# Altium project 1Rv2.PrjPCB (part 1 of 2)
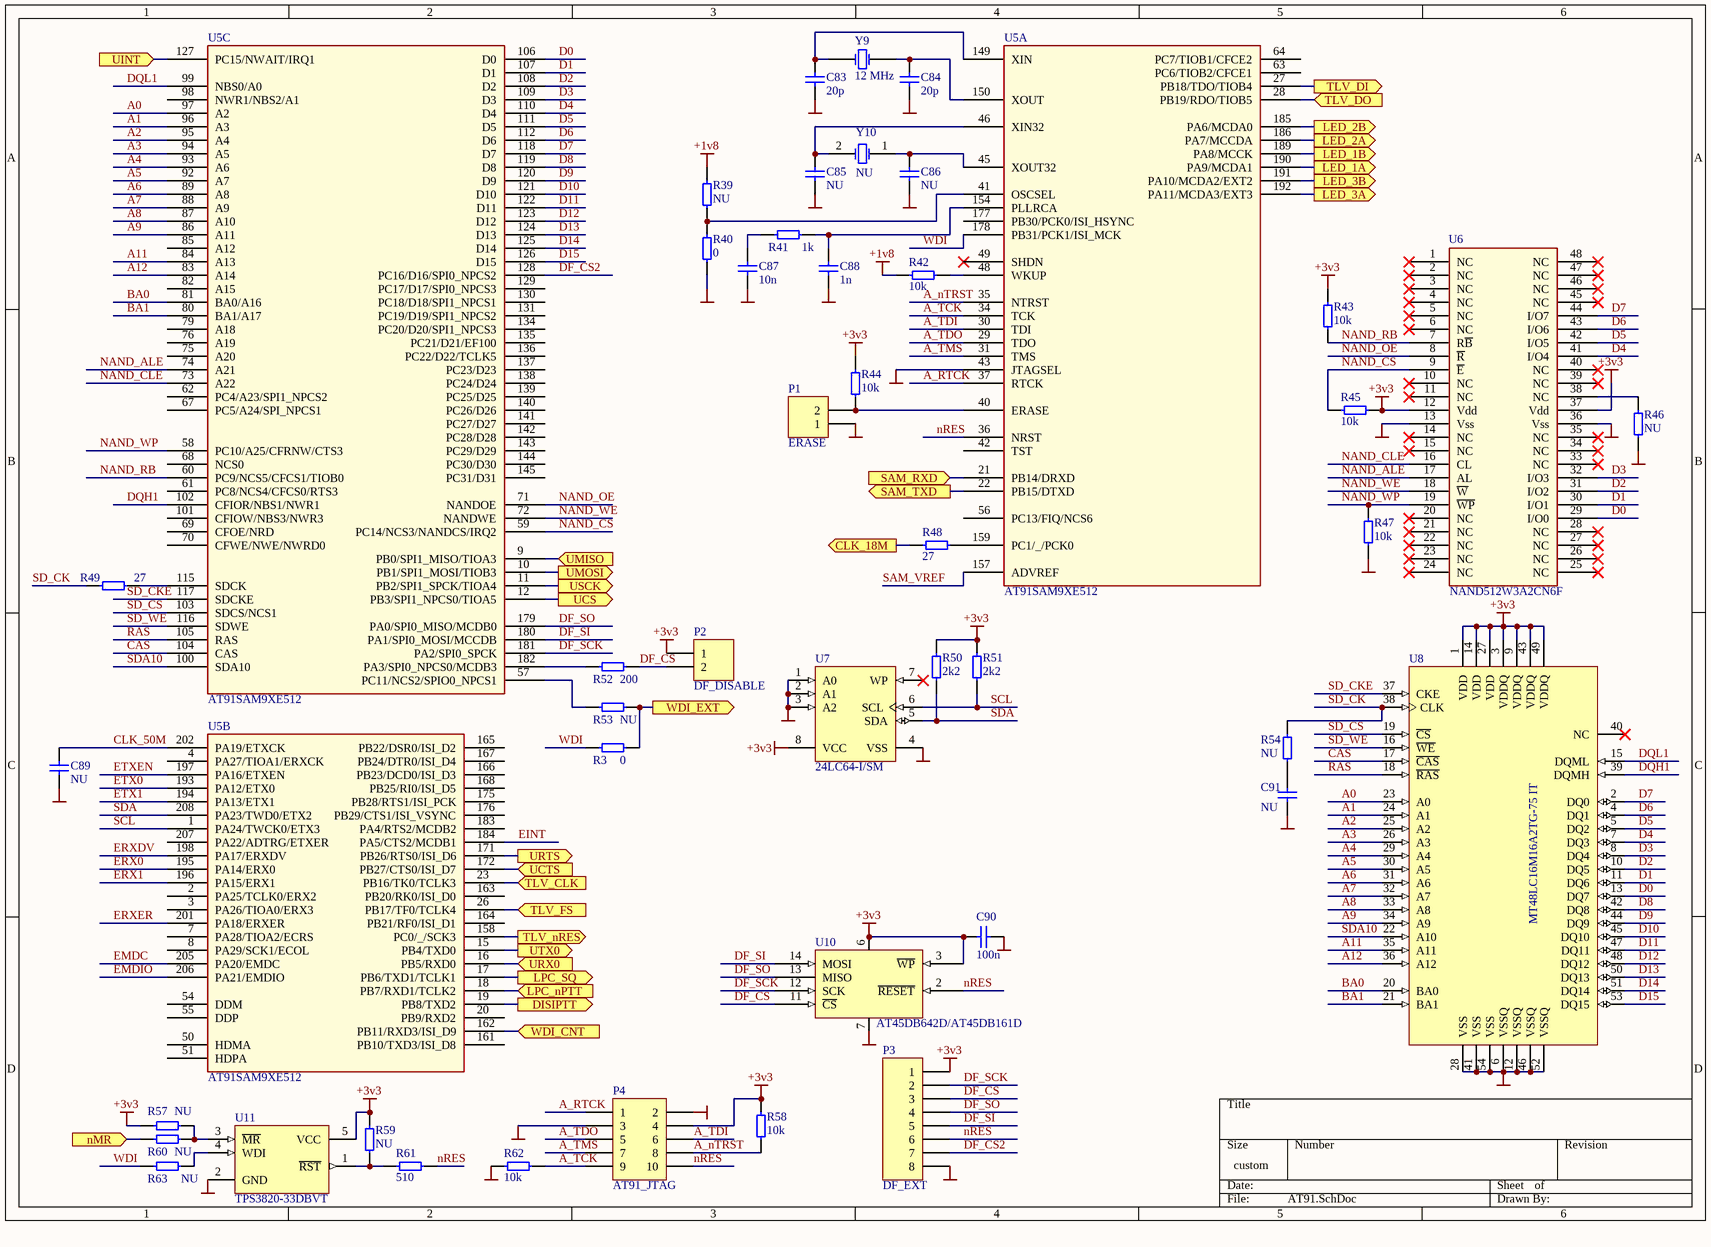
[diagram p0: AT91.SchDoc]
6 sheets, 522 parts. Net scope: global (net labels, ports and power ports of the same name join across sheets).
Board file: Voice_Base_PCB.PcbDoc
Sheets:
  AT91.SchDoc
  INTERFACE.SchDoc
  LPC.SchDoc
  PWR.SchDoc
  RF_ADF.SchDoc
  RF_VCO.SchDoc

## Sheet AT91.SchDoc
size 320 x 228 mm; DocumentNumber: 1; SheetNumber: 1; SheetTotal: 5

### Parts
C83  20p  [CAPC1608L]
C84  20p  [CAPC1608L]
C85  NU  [CAPC1608L]
C86  NU  [CAPC1608L]
C87  10n  [CAPC1608L]
C88  1n  [CAPC1608L]
C89  NU  [CAPC1608L]
C90  100n  [CAPC1608N]
C91  NU  [CAPC1608L]
P1  ERASE  [HDR1X2]
P2  DF_DISABLE  [HDR1X2]
P3  DF_EXT  [HDR1X8]
P4  AT91_JTAG  [HDR2X5]
R3  0  [RESC1608L]
R39  NU  [RESC1608L]
R40  0  [RESC1608L]
R41  1k  [RESC1608L]
R42  10k  [RESC1608L]
R43  10k  [RESC1608L]
R44  10k  [RESC1608L]
R45  10k  [RESC1608L]
R46  NU  [RESC1608L]
R47  10k  [RESC1608L]
R48  27  [RESC1608L]
R49  27  [RESC1608L]
R50  2k2  [RESC1608L]
R51  2k2  [RESC1608L]
R52  200  [RESC1608L]
R53  NU  [RESC1608L]
R54  NU  [RESC1608L]
R57  NU  [RESC1608L]
R58  10k  [RESC1608L]
R59  NU  [RESC1608L]
R60  NU  [RESC1608L]
R61  510  [RESC1608L]
R62  10k  [RESC1608L]
R63  NU  [RESC1608L]
U5  AT91SAM9XE512  [SQFP50P3120X3120-208N]  (parts A,B,C of 4)
U6  NAND512W3A2CN6F  [TSSOP50P2000-48AN]
U7  24LC64-I/SM  [SOIJ-SM8_L]
U8  MT48LC16M16A2TG-75 IT  [SOP80P1176-54N]
U10  AT45DB642D/AT45DB161D  [TSSOP55P1340-28BN]
U11  TPS3820-33DBVT  [SOT23-5]
Y9  12 MHz  [HC49/S]
Y10  NU  [R38]

### Ports
CLK_18M (out), DISIPTT (out), LED_1A (out), LED_1B (out), LED_2A (out), LED_2B (out), LED_3A (out), LED_3B (out), LPC_nPTT (in), LPC_SQ (out), nMR (in), SAM_RXD (in), SAM_TXD (out), TLV_CLK (in), TLV_DI (out), TLV_DO (in), TLV_FS (in), TLV_nRES (out), UCS (out), UCTS (in), UINT (in), UMISO (in), UMOSI (out), URTS (out), URX0 (in), USCK (out), UTX0 (out), WDI_CNT (in), WDI_EXT (out)

### Nets
+1v8: R39.2 R42.2
+3v3: C90.2 P2.1 P3.1 P4.4 R43.2 R44.2 R45.1 R50.2 R51.2 R57.1 R58.2 R59.2 U6.12(Vdd) U6.37(Vdd) U7.8(VCC) U8.1(VDD) U8.3(VDDQ) U8.9(VDDQ) U8.14(VDD) U8.27(VDD) U8.43(VDDQ) U8.49(VDDQ) U10.3(~{WP}) U10.6(VCC) U11.5(VCC)
GND: C83.2 C84.2 C85.2 C86.2 C87.2 C88.2 C89.1 C90.1 C91.1 P1.1 P3.8 P4.2 P4.3 R40.1 R46.2 R47.1 R62.2 U5.43(JTAGSEL) U6.13(Vss) U6.36(Vss) U7.1(A0) U7.2(A1) U7.3(A2) U7.4(VSS) U8.6(VSSQ) U8.12(VSSQ) U8.28(VSS) U8.41(VSS) U8.46(VSSQ) U8.52(VSSQ) U8.54(VSS) U10.7(GND) U11.2(GND)
A0: U5.97(A2) U8.23(A0)
A1: U5.96(A3) U8.24(A1)
A2: U5.95(A4) U8.25(A2)
A3: U5.94(A5) U8.26(A3)
A4: U5.93(A6) U8.29(A4)
A5: U5.92(A7) U8.30(A5)
A6: U5.89(A8) U8.31(A6)
A7: U5.88(A9) U8.32(A7)
A8: U5.87(A10) U8.33(A8)
A9: U5.86(A11) U8.34(A9)
A11: U5.84(A13) U8.35(A11)
A12: U5.83(A14) U8.36(A12)
A_nTRST: P4.8 R58.1 U5.35(NTRST)
A_RTCK: P4.1 U5.37(RTCK)
A_TCK: P4.9 R62.1 U5.34(TCK)
A_TDI: P4.6 U5.30(TDI)
A_TDO: P4.5 U5.29(TDO)
A_TMS: P4.7 U5.31(TMS)
BA0: U5.81(BA0/A16) U8.20(BA0)
BA1: U5.80(BA1/A17) U8.21(BA1)
CAS: U5.104(CAS) U8.17(~{CAS})
CLK_18M: R48.2 ; port CLK_18M
CLK_50M: C89.2 U5.202(PA19/ETXCK)
D0: U5.106(D0) U6.29(I/O0) U8.13(DQ7)
D1: U5.107(D1) U6.30(I/O1) U8.11(DQ6)
D2: U5.108(D2) U6.31(I/O2) U8.10(DQ5)
D3: U5.109(D3) U6.32(I/O3) U8.8(DQ4)
D4: U5.110(D4) U6.41(I/O4) U8.7(DQ3)
D5: U5.111(D5) U6.42(I/O5) U8.5(DQ2)
D6: U5.112(D6) U6.43(I/O6) U8.4(DQ1)
D7: U5.118(D7) U6.44(I/O7) U8.2(DQ0)
D8: U5.119(D8) U8.42(DQ8)
D9: U5.120(D9) U8.44(DQ9)
D10: U5.121(D10) U8.45(DQ10)
D11: U5.122(D11) U8.47(DQ11)
D12: U5.123(D12) U8.48(DQ12)
D13: U5.124(D13) U8.50(DQ13)
D14: U5.125(D14) U8.51(DQ14)
D15: U5.126(D15) U8.53(DQ15)
DF_CS: P2.2 P3.3 R52.1 U10.11(~{CS})
DF_CS2: P3.7 U5.128(PC16/D16/SPI0_NPCS2)
DF_SCK: P3.2 U5.181(PA2/SPI0_SPCK) U10.12(SCK)
DF_SI: P3.5 U5.180(PA1/SPI0_MOSI/MCCDB) U10.14(MOSI)
DF_SO: P3.4 U5.179(PA0/SPI0_MISO/MCDB0) U10.13(MISO)
DISIPTT: U5.19(PB8/TXD2) ; port DISIPTT
DQH1: U5.102(CFIOR/NBS1/NWR1) U8.39(DQMH)
DQL1: U5.99(NBS0/A0) U8.15(DQML)
EINT: U5.184(PA5/CTS2/MCDB1)
EMDC: U5.205(PA20/EMDC)
EMDIO: U5.206(PA21/EMDIO)
ERX0: U5.195(PA14/ERX0)
ERX1: U5.196(PA15/ERX1)
ERXDV: U5.198(PA17/ERXDV)
ERXER: U5.201(PA18/ERXER)
ETX0: U5.193(PA12/ETX0)
ETX1: U5.194(PA13/ETX1)
ETXEN: U5.197(PA16/ETXEN)
LED_1A: U5.190(PA9/MCDA1) ; port LED_1A
LED_1B: U5.189(PA8/MCCK) ; port LED_1B
LED_2A: U5.186(PA7/MCCDA) ; port LED_2A
LED_2B: U5.185(PA6/MCDA0) ; port LED_2B
LED_3A: U5.192(PA11/MCDA3/EXT3) ; port LED_3A
LED_3B: U5.191(PA10/MCDA2/EXT2) ; port LED_3B
LPC_nPTT: U5.18(PB7/RXD1/TCLK2) ; port LPC_nPTT
LPC_SQ: U5.17(PB6/TXD1/TCLK1) ; port LPC_SQ
NAND_ALE: U5.74(A21) U6.17(AL)
NAND_CLE: U5.73(A22) U6.16(CL)
NAND_CS: R45.2 U5.59(PC14/NCS3/NANDCS/IRQ2) U6.9(~{E})
NAND_OE: U5.71(NANDOE) U6.8(~{R})
NAND_RB: R43.1 U5.60(PC9/NCS5/CFCS1/TIOB0) U6.7(R~{B})
NAND_WE: U5.72(NANDWE) U6.18(~{W})
NAND_WP: R47.2 U5.58(PC10/A25/CFRNW/CTS3) U6.19(~{WP})
nMR: R60.1 ; port nMR
nRES: P3.6 P4.10 R61.1 U5.36(NRST) U10.2(~{RESET})
RAS: U5.105(RAS) U8.18(~{RAS})
SAM_RXD: U5.21(PB14/DRXD) ; port SAM_RXD
SAM_TXD: U5.22(PB15/DTXD) ; port SAM_TXD
SAM_VREF: U5.157(ADVREF)
SCL: R51.1 U5.1(PA24/TWCK0/ETX3) U7.6(SCL)
SD_CK: R49.2 R54.2 U8.38(CLK)
SD_CKE: U5.117(SDCKE) U8.37(CKE)
SD_CS: U5.103(SDCS/NCS1) U8.19(~{CS})
SD_WE: U5.116(SDWE) U8.16(~{WE})
SDA: R50.1 U5.208(PA23/TWD0/ETX2) U7.5(SDA)
SDA10: U5.100(SDA10) U8.22(A10)
TLV_CLK: U5.23(PB16/TK0/TCLK3) ; port TLV_CLK
TLV_DI: U5.27(PB18/TDO/TIOB4) ; port TLV_DI
TLV_DO: U5.28(PB19/RDO/TIOB5) ; port TLV_DO
TLV_FS: U5.26(PB17/TF0/TCLK4) ; port TLV_FS
TLV_nRES: U5.158(PC0/_/SCK3) ; port TLV_nRES
UCS: U5.12(PB3/SPI1_NPCS0/TIOA5) ; port UCS
UCTS: U5.172(PB27/CTS0/ISI_D7) ; port UCTS
UINT: U5.127(PC15/NWAIT/IRQ1) ; port UINT
UMISO: U5.9(PB0/SPI1_MISO/TIOA3) ; port UMISO
UMOSI: U5.10(PB1/SPI1_MOSI/TIOB3) ; port UMOSI
URTS: U5.171(PB26/RTS0/ISI_D6) ; port URTS
URX0: U5.16(PB5/RXD0) ; port URX0
USCK: U5.11(PB2/SPI1_SPCK/TIOA4) ; port USCK
UTX0: U5.15(PB4/TXD0) ; port UTX0
WDI: R3.1 R63.2 U5.178(PB31/PCK1/ISI_MCK)
WDI_CNT: U5.162(PB11/RXD3/ISI_D9) ; port WDI_CNT
WDI_EXT: R3.2 R53.2 ; port WDI_EXT
NetC83_1: C83.1 U5.149(XIN) Y9.1(OSC1)
NetC84_1: C84.1 U5.150(XOUT) Y9.2(OSC2)
NetC85_1: C85.1 U5.46(XIN32) Y10.2(OSC2)
NetC86_1: C86.1 U5.45(XOUT32) Y10.1(OSC1)
NetC87_1: C87.1 R41.2
NetC88_1: C88.1 R41.1 U5.154(PLLRCA)
NetC91_2: C91.2 R54.1
NetP1_2: P1.2 R44.1 U5.40(ERASE)
NetR39_1: R39.1 R40.2 U5.41(OSCSEL)
NetR42_1: R42.1 U5.48(WKUP)
NetR46_1: R46.1 U6.38(NC)
NetR48_1: R48.1 U5.159(PC1/_/PCK0)
NetR49_1: R49.1 U5.115(SDCK)
NetR52_2: R52.2 U5.182(PA3/SPI0_NPCS0/MCDB3)
NetR53_1: R53.1 U5.57(PC11/NCS2/SPIO0_NPCS1)
NetR57_2: R57.2 R60.2 U11.3(~{MR})
NetR59_1: R59.1 R61.2 U11.1(~{RST})
NetR63_1: R63.1 U11.4(WDI)

Not connected (* = marked no-connect by the designer): U5 2(PA25/TCLK0/ERX2) 3(PA26/TIOA0/ERX3) 4(PA27/TIOA1/ERXCK) 7(PA28/TIOA2/ECRS) 8(PA29/SCK1/ECOL) 20(PB9/RXD2) 42(TST) 49(SHDN)* 50(HDMA) 51(HDPA) 54(DDM) 55(DDP) 56(PC13/FIQ/NCS6) 61(PC8/NCS4/CFCS0/RTS3) 62(PC4/A23/SPI1_NPCS2) 63(PC6/TIOB2/CFCE1) 64(PC7/TIOB1/CFCE2) 67(PC5/A24/SPI_NPCS1) 68(NCS0) 69(CFOE/NRD) 70(CFWE/NWE/NWRD0) 75(A20) 76(A19) 79(A18) 82(A15) 85(A12) 98(NWR1/NBS2/A1) 101(CFIOW/NBS3/NWR3) 129(PC17/D17/SPI0_NPCS3) 130(PC18/D18/SPI1_NPCS1) 131(PC19/D19/SPI1_NPCS2) 134(PC20/D20/SPI1_NPCS3) 135(PC21/D21/EF100) 136(PC22/D22/TCLK5) 137(PC23/D23) 138(PC24/D24) 139(PC25/D25) 140(PC26/D26) 141(PC27/D27) 142(PC28/D28) 143(PC29/D29) 144(PC30/D30) 145(PC31/D31) 161(PB10/TXD3/ISI_D8) 163(PB20/RK0/ISI_D0) 164(PB21/RF0/ISI_D1) 165(PB22/DSR0/ISI_D2) 166(PB23/DCD0/ISI_D3) 167(PB24/DTR0/ISI_D4) 168(PB25/RI0/ISI_D5) 175(PB28/RTS1/ISI_PCK) 176(PB29/CTS1/ISI_VSYNC) 177(PB30/PCK0/ISI_HSYNC) 183(PA4/RTS2/MCDB2) 207(PA22/ADTRG/ETXER); U6 1(NC)* 2(NC)* 3(NC)* 4(NC)* 5(NC)* 6(NC)* 10(NC)* 11(NC)* 14(NC)* 15(NC)* 20(NC)* 21(NC)* 22(NC)* 23(NC)* 24(NC)* 25(NC)* 26(NC)* 27(NC)* 28(NC)* 33(NC)* 34(NC)* 35(NC)* 39(NC)* 40(NC)* 45(NC)* 46(NC)* 47(NC)* 48(NC)*; U7 7(WP)*; U8 40(NC)*

### Library data of the parts
C83-C91 = Cap: Capacitor; Value: 100pF; Published: 8-Jun-2000; LatestRevisionDate: 17-Jul-2002; LatestRevisionNote: Re-released for DXP Platform.; PackageReference: RAD-0.3; Publisher: Altium Limited
P1 P2 = Header 2: Header, 2-Pin; LatestRevisionDate: 17-Jul-2002; LatestRevisionNote: Re-released for DXP Platform.; Publisher: Altium Limited
P3 = Header 8: Header, 8-Pin; LatestRevisionDate: 17-Jul-2002; LatestRevisionNote: Re-released for DXP Platform.; Publisher: Altium Limited
P4 = Header 5X2: Header, 5-Pin, Dual row; LatestRevisionDate: 17-Jul-2002; LatestRevisionNote: Re-released for DXP Platform.; Publisher: Altium Limited
R3 R39 R40 R42-R54 R57-R63 = Res: Resistor; Value: 1K; Published: 8-Jun-2000; LatestRevisionDate: 04-Mar-2005; LatestRevisionNote: PCB Footprint replaced.; PackageReference: J1-0603; Publisher: Altium Limited
R41 = Res: Resistor; Published: 8-Jun-2000; LatestRevisionDate: 04-Mar-2005; LatestRevisionNote: PCB Footprint replaced.; PackageReference: J1-0603; Publisher: Altium Limited; Value: 1K
U6 = NAND256W3A2BN6E: 256Mbit 528B/264 Word Page , 1.8/3V NAND Flash(x8)
U7 = 24LC128-I/SM: 128Kbit, 400kHz, 2.5V, I2C Serial EEPROM, 8-Pin SOIC 208mil, Industrial Temperature; Published: 29-Jan-2009; DatasheetVersion: revQ, Jun-2008; PackageVersion: revAW, Oct-2008; PackageReference: SOIJ-SM8; Publisher: Altium Limited; PackageDescription: 8-Lead Plastic Small Outline (SM) - Medium, 5.28 mm Body [SOIJ]; ComponentLink1Description: Manufacturer Link; ComponentLink1URL: http://www.microchip.com; ComponentLink2Description: Datasheet; ComponentLink2URL: http://ww1.microchip.com/downloads/en/DeviceDoc/21191Q.pdf; ComponentLink3Description: Packaging Specification; ComponentLink3URL: http://ww1.microchip.com/downloads/en/PackagingSpec/00049AW.pdf
U8 = MT48LC16M16A2TG-75 IT: 256Mb Synchronous High-Speed CMOS DRAM, 16Mb x 16Bit x 4 Banks, 54-Pin TSOP, Industrial; CycleTime: 7.5ns @ CL = 3 (PC133); RowAddress: 8K (A0-A12); ColumnAddress: 512 (A0-A8); Published: 11-Oct-2004; LatestRevisionDate: 13-Apr-2006; LatestRevisionNote: IPC-7351 Footprint Added.; DatasheetVersion: rev.G, Sep-2003; PackageVersion: Sep-2003; PackageReference: TSOP2-54; Publisher: Altium Limited; PackageDescription: 54-Pin Plastic Small Outline Package 0.8 mm Pitch; Code_JEDEC: MS-024-FA; ComponentLink1Description: Manufacturer Link; ComponentLink1URL: http://www.micron.com; ComponentLink2Description: Datasheet; ComponentLink2URL: http://download.micron.com/pdf/datasheets/dram/sdram/256MSDRAM.pdf
U10 = AT45DB642D: 64 Mb 2.5/2.7 V DataFlash
U11 = MAX823LEUK: 5-Pin Microprocessor Supervisory Circuit; Published: 16-Jan-2001; LatestRevisionDate: 17-Jul-2002; LatestRevisionNote: Re-released for DXP Platform.; DatasheetVersion: Jun-1997; PackageReference: SOT23-5; Publisher: Altium Limited; PackageDescription: SOT-23/SC-74A; 5 Leads; Body 3 x 3 mm, inc. leads (LxW max); ComponentLink1Description: Manufacturer Link; ComponentLink1URL: http://www.maxim-ic.com/; ComponentLink2Description: Datasheet; ComponentLink2URL: http://pdfserv.maxim-ic.com/en/ds/MAX823-MAX825.pdf
Y9 Y10 = XTAL: Crystal Oscillator; Published: 8-Jun-2000; LatestRevisionDate: 17-Jul-2002; LatestRevisionNote: Re-released for DXP Platform.; PackageReference: R38; Publisher: Altium Limited

## Sheet INTERFACE.SchDoc
size 320 x 228 mm; DocumentNumber: 3; SheetNumber: 3; SheetTotal: 5
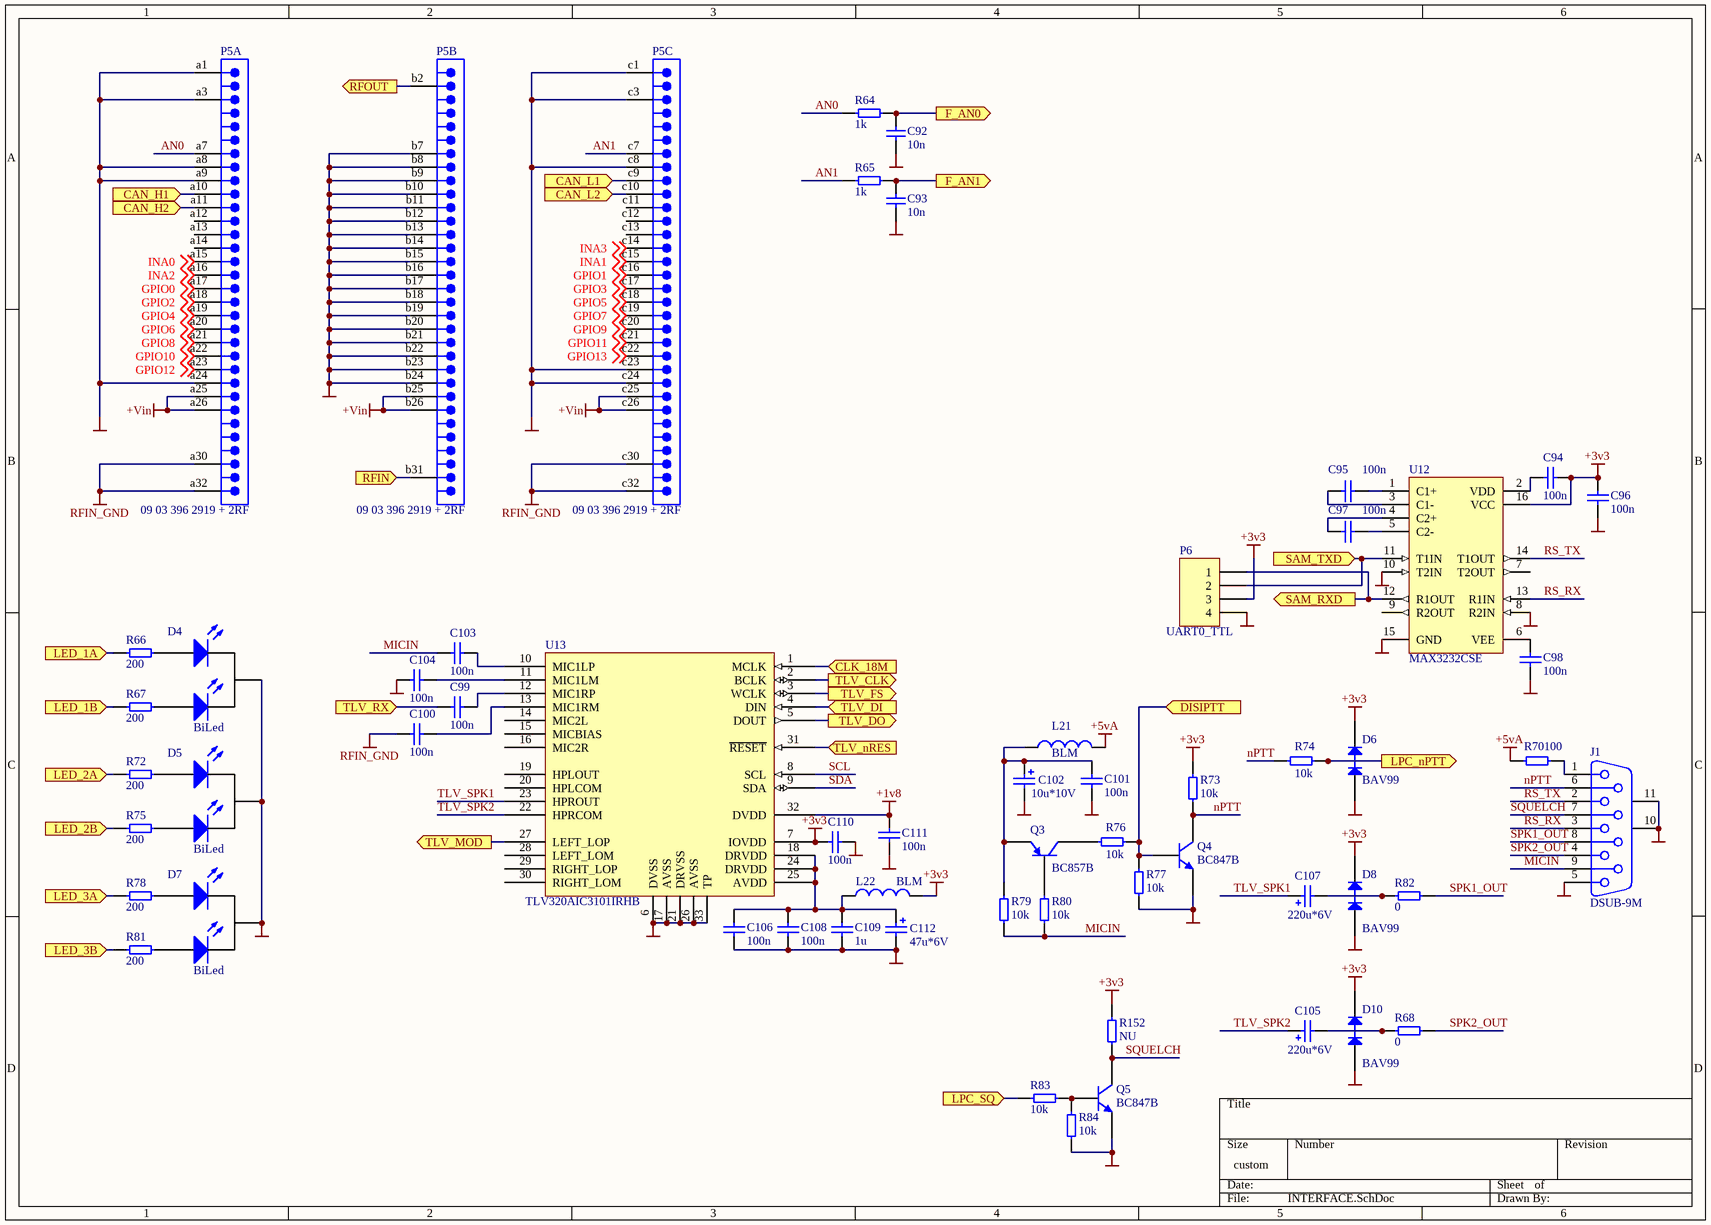
[diagram p1: INTERFACE.SchDoc]

### Parts
C92  10n  [CAPC1608L]
C93  10n  [CAPC1608L]
C94  100n  [CAPC1608N]
C95  100n  [CAPC1608N]
C96  100n  [CAPC1608N]
C97  100n  [CAPC1608N]
C98  100n  [CAPC1608N]
C99  100n  [CAPC1608N]
C100  100n  [CAPC1608N]
C101  100n  [CAPC1608N]
C102  10u*10V  [Case_A]
C103  100n  [CAPC1608N]
C104  100n  [CAPC1608N]
C105  220u*6V  [Case_C]
C106  100n  [CAPC1608N]
C107  220u*6V  [Case_C]
C108  100n  [CAPC1608N]
C109  1u  [CAPC2012N]
C110  100n  [CAPC1608N]
C111  100n  [CAPC1608N]
C112  47u*6V  [Case_A]
D4  BiLed  [BLED-1]
D5  BiLed  [BLED-1]
D6  BAV99  [SOT-23]
D7  BiLed  [BLED-1]
D8  BAV99  [SOT-23]
D10  BAV99  [SOT-23]
J1  DSUB-9M  [DSUB1.385-2H9]
L21  BLM  [INDC2012L]
L22  BLM  [INDC2012L]
P5  09 03 396 2919 + 2RF  [0903396x919]  (parts A,B,C of 4)
P6  UART0_TTL  [HDR1X4]
Q3  BC857B  [SOT23_N]
Q4  BC847B  [SOT23_N]
Q5  BC847B  [SOT23_N]
R64  1k  [RESC1608L]
R65  1k  [RESC1608L]
R66  200  [RESC1608L]
R67  200  [RESC1608L]
R68  0  [RESC2012L]
R70  100  [RESC2012L]
R72  200  [RESC1608L]
R73  10k  [RESC1608L]
R74  10k  [RESC1608L]
R75  200  [RESC1608L]
R76  10k  [RESC1608L]
R77  10k  [RESC1608L]
R78  200  [RESC1608L]
R79  10k  [RESC1608L]
R80  10k  [RESC1608L]
R81  200  [RESC1608L]
R82  0  [RESC2012L]
R83  10k  [RESC1608L]
R84  10k  [RESC1608L]
R152  NU  [RESC1608L]
U12  MAX3232CSE  [NSO16_N]
U13  TLV320AIC3101IRHB  [QFN50P500X500-32W6N]

### Ports
CAN_H1 (in), CAN_H2 (in), CAN_L1 (in), CAN_L2 (in), CLK_18M (in), DISIPTT (in), F_AN0 (out), F_AN1 (out), LED_1A (in), LED_1B (in), LED_2A (in), LED_2B (in), LED_3A (in), LED_3B (in), LPC_nPTT (out), LPC_SQ (in), RFIN (in), RFOUT (out), SAM_RXD (out), SAM_TXD (in), TLV_CLK (out), TLV_DI (in), TLV_DO (out), TLV_FS (out), TLV_MOD (out), TLV_nRES (in), TLV_RX (in)

### Nets
+1v8: C111.2 U13.32(DVDD)
+3v3: C94.1 C96.2 C110.2 D6.2(K) D8.2(K) D10.2(K) L22.1 P6.3 R73.2 R152.2 U12.16(VCC) U13.7(IOVDD)
+5vA: L21.2 R70.1
+Vin: P5.a25 P5.a26 P5.b25 P5.b26 P5.c25 P5.c26
GND: C92.1 C93.1 C96.1 C98.1 C101.2 C102.2 C104.2 C106.1 C108.1 C109.1 C110.1 C111.1 C112.2 D4.2 D5.2 D6.1(A) D7.2 D8.1(A) D10.1(A) J1.5 J1.10(MH1) J1.11(MH2) P5.a1 P5.a3 P5.a8 P5.a9 P5.a24 P5.b7 P5.b8 P5.b9 P5.b10 P5.b11 P5.b12 P5.b13 P5.b14 P5.b15 P5.b16 P5.b17 P5.b18 P5.b19 P5.b20 P5.b21 P5.b22 P5.b23 P5.b24 P5.c1 P5.c3 P5.c8 P5.c23 P5.c24 P6.4 Q4.2(E) Q5.2(E) R77.1 R84.2 U12.8(R2IN) U12.10(T2IN) U12.15(GND) U13.6(DVSS) U13.17(AVSS) U13.21(DRVSS) U13.26(AVSS) U13.33(TP)
RFIN_GND: C100.2 P5.a30 P5.a32 P5.c30 P5.c32
AN0: P5.a7 R64.1
AN1: P5.c7 R65.1
CAN_H1: P5.a10 ; port CAN_H1
CAN_H2: P5.a11 ; port CAN_H2
CAN_L1: P5.c9 ; port CAN_L1
CAN_L2: P5.c10 ; port CAN_L2
CLK_18M: U13.1(MCLK) ; port CLK_18M
DISIPTT: Q4.1(B) R76.1 R77.2 ; port DISIPTT
F_AN0: C92.2 R64.2 ; port F_AN0
F_AN1: C93.2 R65.2 ; port F_AN1
GPIO0: P5.a17 ; off-sheet GPIO0
GPIO1: P5.c16 ; off-sheet GPIO1
GPIO2: P5.a18 ; off-sheet GPIO2
GPIO3: P5.c17 ; off-sheet GPIO3
GPIO4: P5.a19 ; off-sheet GPIO4
GPIO5: P5.c18 ; off-sheet GPIO5
GPIO6: P5.a20 ; off-sheet GPIO6
GPIO7: P5.c19 ; off-sheet GPIO7
GPIO8: P5.a21 ; off-sheet GPIO8
GPIO9: P5.c20 ; off-sheet GPIO9
GPIO10: P5.a22 ; off-sheet GPIO10
GPIO11: P5.c21 ; off-sheet GPIO11
GPIO12: P5.a23 ; off-sheet GPIO12
GPIO13: P5.c22 ; off-sheet GPIO13
INA0: P5.a15 ; off-sheet INA0
INA1: P5.c15 ; off-sheet INA1
INA2: P5.a16 ; off-sheet INA2
INA3: P5.c14 ; off-sheet INA3
LED_1A: R66.2 ; port LED_1A
LED_1B: R67.2 ; port LED_1B
LED_2A: R72.2 ; port LED_2A
LED_2B: R75.2 ; port LED_2B
LED_3A: R78.2 ; port LED_3A
LED_3B: R81.2 ; port LED_3B
LPC_nPTT: D6.3(C) R74.1 ; port LPC_nPTT
LPC_SQ: R83.1 ; port LPC_SQ
MICIN: C103.1 J1.9 R79.1 R80.1
nPTT: J1.6 Q4.3(C) R73.1 R74.2
RFIN: P5.b31 ; port RFIN
RFOUT: P5.b2 ; port RFOUT
RS_RX: J1.3 U12.13(R1IN)
RS_TX: J1.2 U12.14(T1OUT)
SAM_RXD: P6.1 U12.12(R1OUT) ; port SAM_RXD
SAM_TXD: P6.2 U12.11(T1IN) ; port SAM_TXD
SCL: U13.8(SCL)
SDA: U13.9(SDA)
SPK1_OUT: J1.8 R82.2
SPK2_OUT: J1.4 R68.2
SQUELCH: J1.7 Q5.3(C) R152.1
TLV_CLK: U13.2(BCLK) ; port TLV_CLK
TLV_DI: U13.4(DIN) ; port TLV_DI
TLV_DO: U13.5(DOUT) ; port TLV_DO
TLV_FS: U13.3(WCLK) ; port TLV_FS
TLV_MOD: U13.27(LEFT_LOP) ; port TLV_MOD
TLV_nRES: U13.31(~{RESET}) ; port TLV_nRES
TLV_RX: C99.1 ; port TLV_RX
TLV_SPK1: C107.1 U13.23(HPROUT)
TLV_SPK2: C105.1 U13.22(HPRCOM)
NetC94_2: C94.2 U12.2(VDD)
NetC95_1: C95.1 U12.3(C1-)
NetC95_2: C95.2 U12.1(C1+)
NetC97_1: C97.1 U12.4(C2+)
NetC97_2: C97.2 U12.5(C2-)
NetC98_2: C98.2 U12.6(VEE)
NetC99_2: C99.2 U13.12(MIC1RP)
NetC100_1: C100.1 U13.13(MIC1RM)
NetC101_1: C101.1 C102.1 L21.1 Q3.2(E) R79.2
NetC103_2: C103.2 U13.10(MIC1LP)
NetC104_1: C104.1 U13.11(MIC1LM)
NetC105_2: C105.2 D10.3(C) R68.1
NetC106_2: C106.2 C108.2 C109.2 C112.1 L22.2 U13.18(DRVDD) U13.24(DRVDD) U13.25(AVDD)
NetC107_2: C107.2 D8.3(C) R82.1
NetD4_1: D4.1 R66.1
NetD4_3: D4.3 R67.1
NetD5_1: D5.1 R72.1
NetD5_3: D5.3 R75.1
NetD7_1: D7.1 R78.1
NetD7_3: D7.3 R81.1
NetJ1_1: J1.1 R70.2
NetQ3_1: Q3.1(B) R80.2
NetQ3_3: Q3.3(C) R76.2
NetQ5_1: Q5.1(B) R83.2 R84.1

Not connected (* = marked no-connect by the designer): P5 a12 a13 a14 c11 c12 c13; U12 7(T2OUT) 9(R2OUT); U13 14(MIC2L) 15(MICBIAS) 16(MIC2R) 19(HPLOUT) 20(HPLCOM) 28(LEFT_LOM) 29(RIGHT_LOP) 30(RIGHT_LOM)

### Library data of the parts
C92-C101 C103 C104 C106 C108-C111 = Cap: Capacitor; Value: 100pF; Published: 8-Jun-2000; LatestRevisionDate: 17-Jul-2002; LatestRevisionNote: Re-released for DXP Platform.; PackageReference: RAD-0.3; Publisher: Altium Limited
C102 C105 C107 C112 = Cap Pol: Polarized Capacitor (Surface Mount); Value: 100pF; Published: 8-Jun-2000; LatestRevisionDate: 17-Jul-2002; LatestRevisionNote: Re-released for DXP Platform.; PackageReference: C0805; Publisher: Altium Limited
D6 D8 D10 = BAV99: Silicon Switching Diode Array for High-Speed Switching; Published: 21-Mar-2003; DatasheetDocument: Oct-1999; PackageDocument: Sep-2001; PackageReference: SOT-23; Publisher: Altium Limited; ComponentLink1Description: Manufacturer Link; ComponentLink1URL: http://www.infineon.com/; ComponentLink2Description: Datasheet; ComponentLink2URL: http://www.infineon.com/upload/Document/cmc_upload/documents/080/631/bav99series_1.pdf
J1 = D Connector 9: Receptacle Assembly, 9 Position, Right Angle; PackageDocument: O; Positions: 9; Published: 15-Jun-2001; LatestRevisionDate: 17-Jul-2002; LatestRevisionNote: Re-released for DXP Platform.; DatasheetDocument: 1-Sep-1999; PackageReference: 788750; Publisher: Altium Limited; Orientation: Right Angle; Gender: Receptacle
L21 L22 = INDUCTOR
P5 = 09 03 396 2919: Eurocard DIN 41612, Type C, 96 Position, Rows a+b+c, Performance level 1, Male, Lead 3.0 mm, Pitch 2.54 mm; DrillSize: Corresponds to nominal value.; Published: 6-Oct-2005; DatasheetDocument: 03-Jun-2003; PackageDocument: 25-Jan-2002; PackageReference: 0903396x919; Publisher: Altium Limited; ComponentLink1Description: Manufacturer Link; ComponentLink1URL: http://www.harting.com/; ComponentLink2Description: Packaging Specification; ComponentLink2URL: http://www.harkis.harting.com/_gds/pdf/TB_0903396x919_BL01_R30797.pdf
P6 = Header 4: Header, 4-Pin; LatestRevisionDate: 17-Jul-2002; LatestRevisionNote: Re-released for DXP Platform.; Publisher: Altium Limited
Q3 = BC857B: PNP General-purpose Transistor; Published: 17-Sep-2003; LatestRevisionDate: 12-Dec-2006; LatestRevisionNote: IPC-7351 Footprint Added.; DatasheetVersion: 4-Feb-2002; PackageVersion: May-1999; PackageReference: SOT23; Publisher: Altium Limited; PackageDescription: 3-Pin SOT-23 Package 0.95 mm Pitch, 2.3 mm Lead Span; ComponentLink1Description: Manufacturer Link; ComponentLink1URL: http://www.semiconductors.philips.com/; ComponentLink2Description: Datasheet; ComponentLink2URL: http://www.semiconductors.philips.com/acrobat/datasheets/BC856_BC857_BC858_6.pdf
Q4 Q5 = BC847B: NPN General-purpose Transistor; Published: 17-Sep-2003; LatestRevisionDate: 12-Dec-2006; LatestRevisionNote: IPC-7351 Footprint Added.; DatasheetVersion: 4-Feb-2002; PackageVersion: May-1999; PackageReference: SOT23; Publisher: Altium Limited; PackageDescription: 3-Pin SOT-23 Package 0.95 mm Pitch, 2.3 mm Lead Span; ComponentLink1Description: Manufacturer Link; ComponentLink1URL: http://www.semiconductors.philips.com/; ComponentLink2Description: Datasheet; ComponentLink2URL: http://www.semiconductors.philips.com/acrobat/datasheets/BC846_BC847_BC848_5.pdf
R64 R65 = Res: Resistor; Published: 8-Jun-2000; LatestRevisionDate: 04-Mar-2005; LatestRevisionNote: PCB Footprint replaced.; PackageReference: J1-0603; Publisher: Altium Limited; Value: 1K
R66-R68 R70 R72-R84 R152 = Res: Resistor; Value: 1K; Published: 8-Jun-2000; LatestRevisionDate: 04-Mar-2005; LatestRevisionNote: PCB Footprint replaced.; PackageReference: J1-0603; Publisher: Altium Limited
U12 = MAX232CSE: +5V Powered, Multi-Channel RS-232 Driver/Receiver; Published: 16-Jan-2001; LatestRevisionDate: 13-Apr-2006; LatestRevisionNote: IPC-7351 Footprint Added.; PackageReference: NSO16; Publisher: Altium Limited; PackageDescription: 16-Pin Small Outline Integrated Circuit 1.27 mm Pitch; Code_JEDEC: MS-012-AC; Code_IPC: SOIC127P600-16; ComponentLink1Description: Manufacturer Link; ComponentLink1URL: http://www.maxim-ic.com/; ComponentLink2Description: Datasheet; ComponentLink2URL: http://pdfserv.maxim-ic.com/en/ds/MAX220-MAX249.pdf
U13 = TLV320AIC3101IRHB: Low-power stereo codec

## Sheet LPC.SchDoc
size 320 x 228 mm; DocumentNumber: 2; SheetNumber: 2; SheetTotal: 5
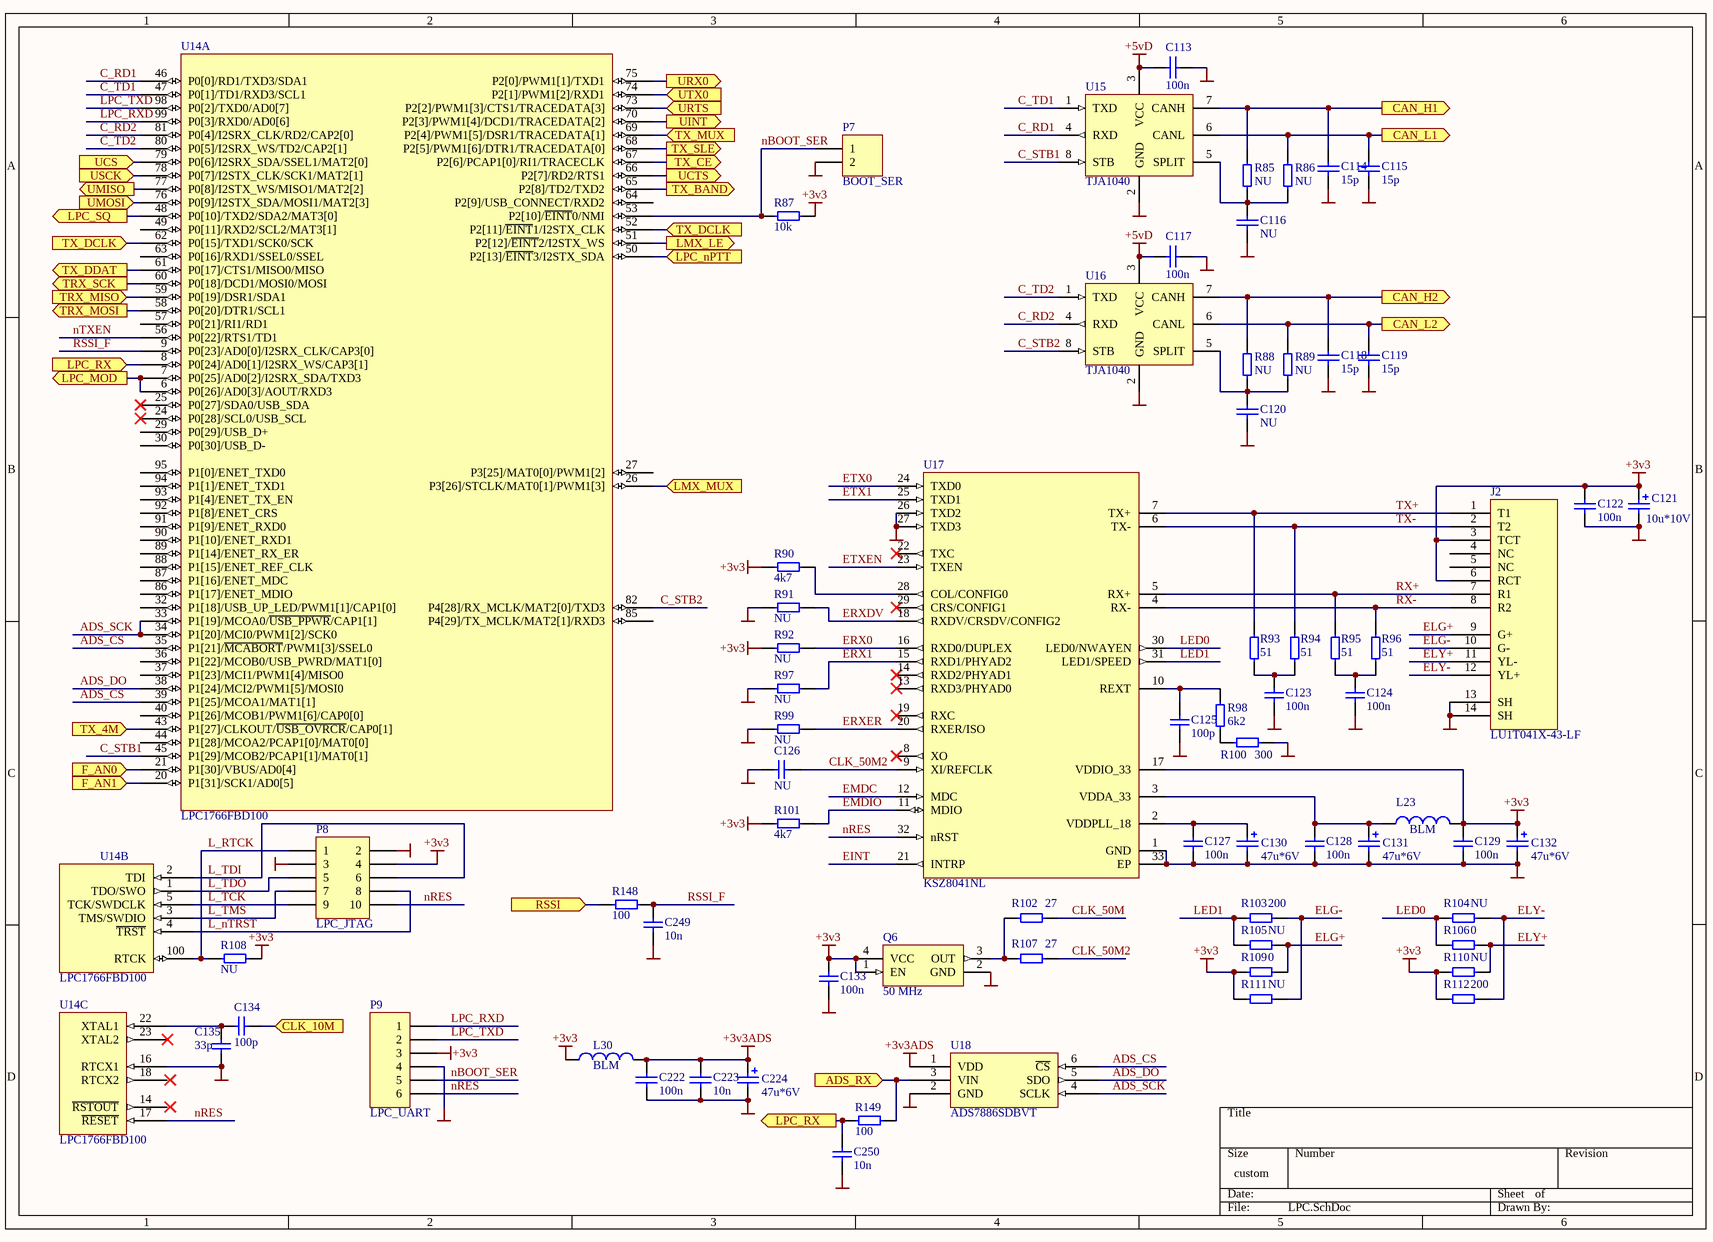
[diagram p2: LPC.SchDoc]

### Parts
C113  100n  [CAPC1608N]
C114  15p  [CAPC1608N]
C115  15p  [CAPC1608N]
C116  NU  [CAPC1608N]
C117  100n  [CAPC1608N]
C118  15p  [CAPC1608N]
C119  15p  [CAPC1608N]
C120  NU  [CAPC1608N]
C121  10u*10V  [Case_A]
C122  100n  [CAPC1608N]
C123  100n  [CAPC1608L]
C124  100n  [CAPC1608L]
C125  100p  [CAPC1608L]
C126  NU  [CAPC1608L]
C127  100n  [CAPC1608L]
C128  100n  [CAPC1608L]
C129  100n  [CAPC1608L]
C130  47u*6V  [Case_A]
C131  47u*6V  [Case_A]
C132  47u*6V  [Case_A]
C133  100n  [CAPC1608L]
C134  100p  [CAPC1608L]
C135  33p  [CAPC1608L]
C222  100n  [CAPC1608N]
C223  10n  [CAPC1608N]
C224  47u*6V  [Case_A]
C249  10n  [CAPC1608L]
C250  10n  [CAPC1608L]
J2  LU1T041X-43-LF  [JACK1.27-4H8C]
L23  BLM  [INDC2012L]
L30  BLM  [CAPC2012N]
P7  BOOT_SER  [HDR1X2]
P8  LPC_JTAG  [HDR2X5]
P9  LPC_UART  [HDR1X6]
Q6  50 MHz  [XTAL_7.5_5mm]
R85  NU  [RESC2012L]
R86  NU  [RESC2012L]
R87  10k  [RESC1608L]
R88  NU  [RESC2012L]
R89  NU  [RESC2012L]
R90  4k7  [RESC1608L]
R91  NU  [RESC1608L]
R92  NU  [RESC1608L]
R93  51  [RESC1608L]
R94  51  [RESC1608L]
R95  51  [RESC1608L]
R96  51  [RESC1608L]
R97  NU  [RESC1608L]
R98  6k2  [RESC1608L]
R99  NU  [RESC1608L]
R100  300  [RESC1608L]
R101  4k7  [RESC1608L]
R102  27  [RESC1608L]
R103  200  [RESC1608L]
R104  NU  [RESC1608L]
R105  NU  [RESC1608L]
R106  0  [RESC1608L]
R107  27  [RESC1608L]
R108  NU  [RESC1608L]
R109  0  [RESC1608L]
R110  NU  [RESC1608L]
R111  NU  [RESC1608L]
R112  200  [RESC1608L]
R148  100  [RESC1608L]
R149  100  [RESC1608L]
U14  LPC1766FBD100  [SOT407-1_L]  (parts A,B,C of 4)
U15  TJA1040  [SOIC-150-8]
U16  TJA1040  [SOIC-150-8]
U17  KSZ8041NL  [QFN50P500X500-32WAN]
U18  ADS7886SDBVT  [SOT26A-6N]

### Ports
ADS_RX (in), CAN_H1 (out), CAN_H2 (out), CAN_L1 (out), CAN_L2 (out), CLK_10M (in), F_AN0 (in), F_AN1 (in), LMX_LE (out), LMX_MUX (in), LPC_MOD (out), LPC_nPTT (in), LPC_RX (in), LPC_RX (out), LPC_SQ (out), RSSI (in), TRX_MISO (in), TRX_MOSI (out), TRX_SCK (out), TX_4M (in), TX_BAND (out), TX_CE (out), TX_DCLK (in), TX_DDAT (out), TX_MUX (in), TX_SLE (out), UCS (in), UCTS (out), UINT (out), UMISO (out), UMOSI (in), URTS (in), URX0 (out), USCK (in), UTX0 (in)

### Nets
+3v3: C121.1 C122.2 C129.2 C132.1 C133.2 J2.3(TCT) J2.6(RCT) L23.2 L30.1 P8.4 P9.3 Q6.1(EN) Q6.4(VCC) R87.2 R90.2 R92.2 R101.2 R108.1 R109.2 R110.2 R111.2 R112.2 U17.17(VDDIO_33)
+3v3ADS: C222.2 C223.2 C224.1 L30.2 U18.1(VDD)
+5vD: C113.1 C117.1 U15.3(VCC) U16.3(VCC)
GND: C113.2 C114.1 C115.1 C116.1 C117.2 C118.1 C119.1 C120.1 C121.2 C122.1 C123.1 C124.1 C125.1 C126.2 C127.1 C128.1 C129.1 C130.2 C131.2 C132.2 C133.1 C135.1 C222.1 C223.1 C224.2 C249.1 C250.1 J2.13(SH) J2.14(SH) P7.2 P8.2 P8.3 P9.4 Q6.2(GND) R91.2 R97.2 R99.2 R100.1 U14.16(RTCX1) U15.2(GND) U16.2(GND) U17.1(GND) U17.26(TXD2) U17.27(TXD3) U17.33(EP) U18.2(GND)
ADS_CS: U14.35(P1[21]/~{MCABORT}/PWM1[3]/SSEL0) U14.39(P1[25]/MCOA1/MAT1[1]) U18.6(~{CS})
ADS_DO: U14.38(P1[24]/MCI2/PWM1[5]/MOSI0) U18.5(SDO)
ADS_RX: R149.2 U18.3(VIN) ; port ADS_RX
ADS_SCK: U14.33(P1[19]/MCOA0/~{USB_PPWR}/CAP1[1]) U14.34(P1[20]/MCI0/PWM1[2]/SCK0) U18.4(SCLK)
C_RD1: U14.46(P0[0]/RD1/TXD3/SDA1) U15.4(RXD)
C_RD2: U14.81(P0[4]/I2SRX_CLK/RD2/CAP2[0]) U16.4(RXD)
C_STB1: U14.45(P1[29]/MCOB2/PCAP1[1]/MAT0[1]) U15.8(STB)
C_STB2: U14.82(P4[28]/RX_MCLK/MAT2[0]/TXD3) U16.8(STB)
C_TD1: U14.47(P0[1]/TD1/RXD3/SCL1) U15.1(TXD)
C_TD2: U14.80(P0[5]/I2SRX_WS/TD2/CAP2[1]) U16.1(TXD)
CAN_H1: C114.2 R85.1 U15.7(CANH) ; port CAN_H1
CAN_H2: C118.2 R88.1 U16.7(CANH) ; port CAN_H2
CAN_L1: C115.2 R86.1 U15.6(CANL) ; port CAN_L1
CAN_L2: C119.2 R89.1 U16.6(CANL) ; port CAN_L2
CLK_10M: C134.2 ; port CLK_10M
CLK_50M: R102.2
CLK_50M2: C126.1 R107.2 U17.9(XI/REFCLK)
EINT: U17.21(INTRP)
ELG+: J2.9(G+) R105.1 R109.1
ELG-: J2.10(G-) R103.1 R111.1
ELY+: J2.11(YL-) R106.1 R110.1
ELY-: J2.12(YL+) R104.1 R112.1
EMDC: U17.12(MDC)
EMDIO: R101.1 U17.11(MDIO)
ERX0: R92.1 U17.16(RXD0/DUPLEX)
ERX1: R97.1 U17.15(RXD1/PHYAD2)
ERXDV: R91.1 U17.18(RXDV/CRSDV/CONFIG2)
ERXER: R99.1 U17.20(RXER/ISO)
ETX0: U17.24(TXD0)
ETX1: U17.25(TXD1)
ETXEN: U17.23(TXEN)
F_AN0: U14.21(P1[30]/VBUS/AD0[4]) ; port F_AN0
F_AN1: U14.20(P1[31]/SCK1/AD0[5]) ; port F_AN1
L_nTRST: P8.8 U14.4(~{TRST})
L_RTCK: P8.1 R108.2 U14.100(RTCK)
L_TCK: P8.9 U14.5(TCK/SWDCLK)
L_TDI: P8.6 U14.2(TDI)
L_TDO: P8.5 U14.1(TDO/SWO)
L_TMS: P8.7 U14.3(TMS/SWDIO)
LED0: R104.2 R106.2 U17.30(LED0/NWAYEN)
LED1: R103.2 R105.2 U17.31(LED1/SPEED)
LMX_LE: U14.51(P2[12]/~{EINT}2/I2STX_WS) ; port LMX_LE
LMX_MUX: U14.26(P3[26]/STCLK/MAT0[1]/PWM1[3]) ; port LMX_MUX
LPC_MOD: U14.6(P0[26]/AD0[3]/AOUT/RXD3) U14.7(P0[25]/AD0[2]/I2SRX_SDA/TXD3) ; port LPC_MOD
LPC_nPTT: U14.50(P2[13]/~{EINT}3/I2STX_SDA) ; port LPC_nPTT
LPC_RX: C250.2 R149.1 U14.8(P0[24]/AD0[1]/I2SRX_WS/CAP3[1]) ; port LPC_RX
LPC_RXD: P9.1 U14.99(P0[3]/RXD0/AD0[6])
LPC_SQ: U14.48(P0[10]/TXD2/SDA2/MAT3[0]) ; port LPC_SQ
LPC_TXD: P9.2 U14.98(P0[2]/TXD0/AD0[7])
nBOOT_SER: P7.1 P9.5 R87.1 U14.53(P2[10]/~{EINT}0/NMI)
nRES: P8.10 P9.6 U14.17(~{RESET}) U17.32(nRST)
nTXEN: U14.56(P0[22]/RTS1/TD1)
RSSI: R148.1 ; port RSSI
RSSI_F: C249.2 R148.2 U14.9(P0[23]/AD0[0]/I2SRX_CLK/CAP3[0])
RX+: J2.7(R1) R95.2 U17.5(RX+)
RX-: J2.8(R2) R96.2 U17.4(RX-)
TRX_MISO: U14.59(P0[19]/DSR1/SDA1) ; port TRX_MISO
TRX_MOSI: U14.58(P0[20]/DTR1/SCL1) ; port TRX_MOSI
TRX_SCK: U14.60(P0[18]/DCD1/MOSI0/MOSI) ; port TRX_SCK
TX+: J2.1(T1) R93.2 U17.7(TX+)
TX-: J2.2(T2) R94.2 U17.6(TX-)
TX_4M: U14.43(P1[27]/CLKOUT/~{USB_OVRCR}/CAP0[1]) ; port TX_4M
TX_BAND: U14.65(P2[8]/TD2/TXD2) ; port TX_BAND
TX_CE: U14.67(P2[6]/PCAP1[0]/RI1/TRACECLK) ; port TX_CE
TX_DCLK: U14.52(P2[11]/~{EINT}1/I2STX_CLK) U14.62(P0[15]/TXD1/SCK0/SCK) ; port TX_DCLK
TX_DDAT: U14.61(P0[17]/CTS1/MISO0/MISO) ; port TX_DDAT
TX_MUX: U14.69(P2[4]/PWM1[5]/DSR1/TRACEDATA[1]) ; port TX_MUX
TX_SLE: U14.68(P2[5]/PWM1[6]/DTR1/TRACEDATA[0]) ; port TX_SLE
UCS: U14.79(P0[6]/I2SRX_SDA/SSEL1/MAT2[0]) ; port UCS
UCTS: U14.66(P2[7]/RD2/RTS1) ; port UCTS
UINT: U14.70(P2[3]/PWM1[4]/DCD1/TRACEDATA[2]) ; port UINT
UMISO: U14.77(P0[8]/I2STX_WS/MISO1/MAT2[2]) ; port UMISO
UMOSI: U14.76(P0[9]/I2STX_SDA/MOSI1/MAT2[3]) ; port UMOSI
URTS: U14.73(P2[2]/PWM1[3]/CTS1/TRACEDATA[3]) ; port URTS
URX0: U14.75(P2[0]/PWM1[1]/TXD1) ; port URX0
USCK: U14.78(P0[7]/I2STX_CLK/SCK1/MAT2[1]) ; port USCK
UTX0: U14.74(P2[1]/PWM1[2]/RXD1) ; port UTX0
NetC116_2: C116.2 R85.2 R86.2 U15.5(SPLIT)
NetC120_2: C120.2 R88.2 R89.2 U16.5(SPLIT)
NetC123_2: C123.2 R93.1 R94.1
NetC124_2: C124.2 R95.1 R96.1
NetC125_2: C125.2 R98.2 U17.10(REXT)
NetC127_2: C127.2 C130.1 U17.2(VDDPLL_18)
NetC128_2: C128.2 C131.1 L23.1 U17.3(VDDA_33)
NetC134_1: C134.1 C135.2 U14.22(XTAL1)
NetQ6_3: Q6.3(OUT) R102.1 R107.1
NetR90_1: R90.1 U17.28(COL/CONFIG0)
NetR98_1: R98.1 R100.2

Not connected (* = marked no-connect by the designer): J2 4(NC) 5(NC); U14 14(~{RSTOUT}) 18(RTCX2) 23(XTAL2)* 24(P0[28]/SCL0/USB_SCL)* 25(P0[27]/SDA0/USB_SDA)* 27(P3[25]/MAT0[0]/PWM1[2]) 29(P0[29]/USB_D+) 30(P0[30]/USB_D-) 32(P1[18]/USB_UP_LED/PWM1[1]/CAP1[0]) 36(P1[22]/MCOB0/USB_PWRD/MAT1[0]) 37(P1[23]/MCI1/PWM1[4]/MISO0) 40(P1[26]/MCOB1/PWM1[6]/CAP0[0]) 44(P1[28]/MCOA2/PCAP1[0]/MAT0[0]) 49(P0[11]/RXD2/SCL2/MAT3[1]) 57(P0[21]/RI1/RD1) 63(P0[16]/RXD1/SSEL0/SSEL) 64(P2[9]/USB_CONNECT/RXD2) 85(P4[29]/TX_MCLK/MAT2[1]/RXD3) 86(P1[17]/ENET_MDIO) 87(P1[16]/ENET_MDC) 88(P1[15]/ENET_REF_CLK) 89(P1[14]/ENET_RX_ER) 90(P1[10]/ENET_RXD1) 91(P1[9]/ENET_RXD0) 92(P1[8]/ENET_CRS) 93(P1[4]/ENET_TX_EN) 94(P1[1]/ENET_TXD1) 95(P1[0]/ENET_TXD0); U17 8(XO)* 13(RXD3/PHYAD0)* 14(RXD2/PHYAD1)* 19(RXC)* 22(TXC)* 29(CRS/CONFIG1)*

### Library data of the parts
C113-C120 C122-C129 C133-C135 C222 C223 C249 C250 = Cap: Capacitor; Value: 100pF; Published: 8-Jun-2000; LatestRevisionDate: 17-Jul-2002; LatestRevisionNote: Re-released for DXP Platform.; PackageReference: RAD-0.3; Publisher: Altium Limited
C121 C130-C132 C224 = Cap Pol: as C102 on sheet INTERFACE; Published: 8-Jun-2000; LatestRevisionDate: 17-Jul-2002; LatestRevisionNote: Re-released for DXP Platform.; PackageReference: C0805; Publisher: Altium Limited
J2 = LU1T516-43: Ethernet 10/100 jack with magnetics
L23 = INDUCTOR
L30 = Ferrite Bead: Code_IEC: 1005; Value: 10mH; Published: 8-Jun-2000; LatestRevisionDate: 17-Jul-2002; LatestRevisionNote: Re-released for DXP Platform.; PackageReference: 0402-A; Publisher: Altium Limited; Code_JEITA: 0402
P7 = Header 2: Header, 2-Pin; LatestRevisionDate: 17-Jul-2002; LatestRevisionNote: Re-released for DXP Platform.; Publisher: Altium Limited
P8 = Header 5X2: Header, 5-Pin, Dual row; LatestRevisionDate: 17-Jul-2002; LatestRevisionNote: Re-released for DXP Platform.; Publisher: Altium Limited
P9 = Header 6: Header, 6-Pin; LatestRevisionDate: 17-Jul-2002; LatestRevisionNote: Re-released for DXP Platform.; Publisher: Altium Limited
Q6 = XTAL_OSC: Crystal Oscillator
R85-R112 R148 R149 = Res: Resistor; Value: 1K; Published: 8-Jun-2000; LatestRevisionDate: 04-Mar-2005; LatestRevisionNote: PCB Footprint replaced.; PackageReference: J1-0603; Publisher: Altium Limited
U14 = LPC1766FBD100: ARM Cortex-M3 32-Bit Microcontroller, 512kB Flash,64kB SRAM w Ethernet,USB 2.0,Host/Device/OTG, CAN 100-Lead LQFP; Code_IEC: 136E20; Published: 17-Aug-2007; DatasheetVersion: rev.01, Jan-2007; PackageVersion: Feb-2003; PackageReference: SOT407-1; Publisher: Altium Limited; PackageDescription: 100-Pin Plastic Low Profile Quad Flat Pack, LQFP100; Code_JEDEC: MS-026; ComponentLink1Description: Manufacturer Link; ComponentLink1URL: http://www.nxp.com/; ComponentLink2Description: Datasheet; ComponentLink2URL: http://www.standardics.nxp.com/products/lpc2000/datasheet/lpc2364.lpc2366.lpc2368.pdf
U15 U16 = TJA1040: High-Speed CAN Tranceiver
U17 = KSZ8041: 10Base-T/100Base-TX Physical Layer Transceiver
U18 = ADS7886: 12-Bit, 1-MSPS, Micro-power ADC

## Sheet PWR.SchDoc
size 320 x 228 mm; DocumentNumber: 4; SheetNumber: 4; SheetTotal: 5
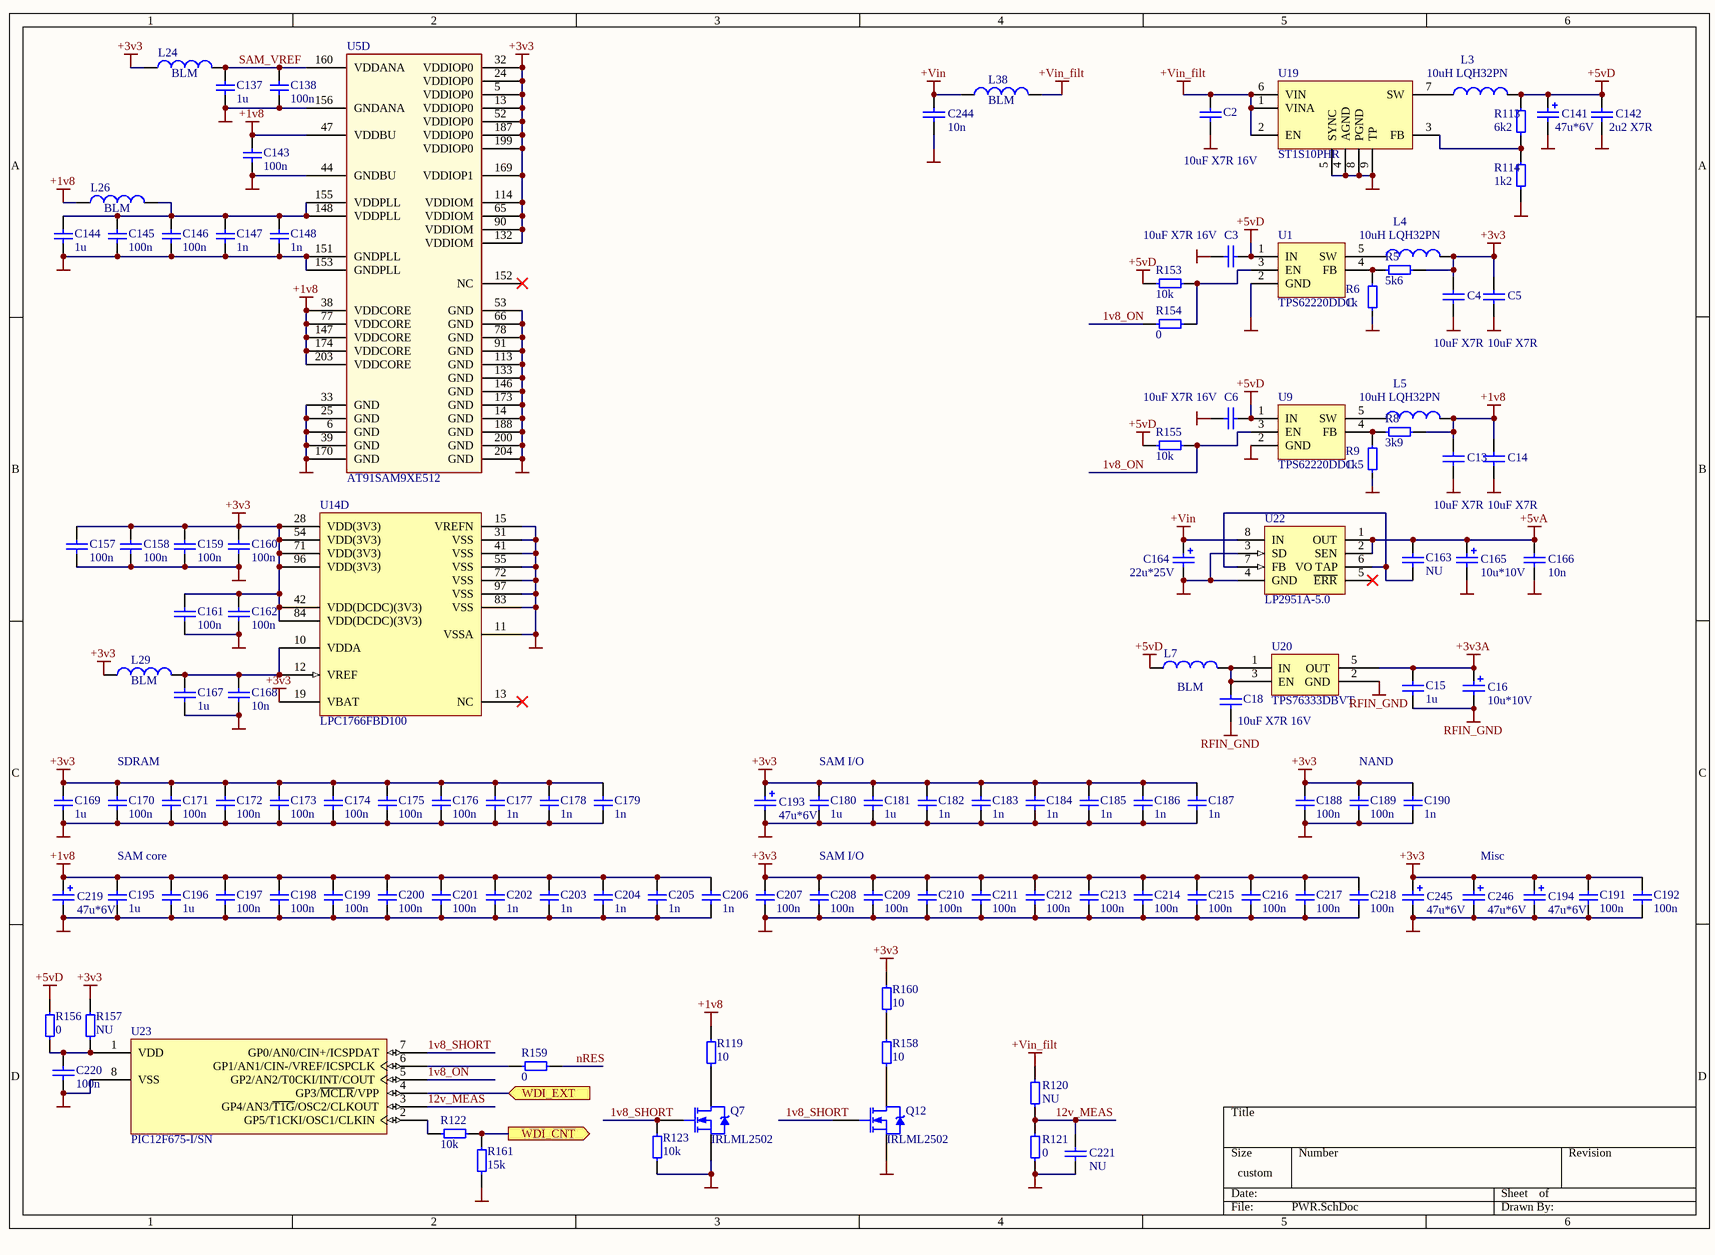
[diagram p3: PWR.SchDoc]

### Parts
C2  10uF X7R 16V  [CAPC3216M]
C3  10uF X7R 16V  [CAPC3216M]
C4  10uF X7R  [CAPC3216M]
C5  10uF X7R  [CAPC3216M]
C6  10uF X7R 16V  [CAPC3216M]
C13  10uF X7R  [CAPC3216M]
C14  10uF X7R  [CAPC3216M]
C15  1u  [CAPC2012L]
C16  10u*10V  [Case_A]
C18  10uF X7R 16V  [CAPC3216M]
C137  1u  [CAPC2012L]
C138  100n  [CAPC1608L]
C141  47u*6V  [Case_A]
C142  2u2 X7R  [CAPC2012N]
C143  100n  [CAPC1608L]
C144  1u  [CAPC2012L]
C145  100n  [CAPC1608L]
C146  100n  [CAPC1608L]
C147  1n  [CAPC1608L]
C148  1n  [CAPC1608L]
C157  100n  [CAPC1608N]
C158  100n  [CAPC1608N]
C159  100n  [CAPC1608N]
C160  100n  [CAPC1608N]
C161  100n  [CAPC1608N]
C162  100n  [CAPC1608N]
C163  NU  [CAPC1608N]
C164  22u*25V  [Case_D]
C165  10u*10V  [Case_A]
C166  10n  [CAPC1608N]
C167  1u  [CAPC2012L]
C168  10n  [CAPC1608N]
C169  1u  [CAPC2012L]
C170  100n  [CAPC1608L]
C171  100n  [CAPC1608L]
C172  100n  [CAPC1608L]
C173  100n  [CAPC1608L]
C174  100n  [CAPC1608L]
C175  100n  [CAPC1608L]
C176  100n  [CAPC1608L]
C177  1n  [CAPC1608L]
C178  1n  [CAPC1608L]
C179  1n  [CAPC1608L]
C180  1u  [CAPC2012L]
C181  1u  [CAPC2012L]
C182  1n  [CAPC1608L]
C183  1n  [CAPC1608L]
C184  1n  [CAPC1608L]
C185  1n  [CAPC1608L]
C186  1n  [CAPC1608L]
C187  1n  [CAPC1608L]
C188  100n  [CAPC1608L]
C189  100n  [CAPC1608L]
C190  1n  [CAPC1608L]
C191  100n  [CAPC1608L]
C192  100n  [CAPC1608L]
C193  47u*6V  [Case_A]
C194  47u*6V  [Case_A]
C195  1u  [CAPC2012L]
C196  1u  [CAPC2012L]
C197  100n  [CAPC1608L]
C198  100n  [CAPC1608L]
C199  100n  [CAPC1608L]
C200  100n  [CAPC1608L]
C201  100n  [CAPC1608L]
C202  1n  [CAPC1608L]
C203  1n  [CAPC1608L]
C204  1n  [CAPC1608L]
C205  1n  [CAPC1608L]
C206  1n  [CAPC1608L]
C207  100n  [CAPC1608L]
C208  100n  [CAPC1608L]
C209  100n  [CAPC1608L]
C210  100n  [CAPC1608L]
C211  100n  [CAPC1608L]
C212  100n  [CAPC1608L]
C213  100n  [CAPC1608L]
C214  100n  [CAPC1608L]
C215  100n  [CAPC1608L]
C216  100n  [CAPC1608L]
C217  100n  [CAPC1608L]
C218  100n  [CAPC1608L]
C219  47u*6V  [Case_A]
C220  100n  [CAPC1608N]
C221  NU  [CAPC1608N]
C244  10n  [CAPC1608N]
C245  47u*6V  [Case_A]
C246  47u*6V  [Case_A]
L3  10uH LQH32PN  [CAPC3225N]
L4  10uH LQH32PN  [CAPC3225N]
L5  10uH LQH32PN  [CAPC3225N]
L7  BLM  [CAPC2012N]
L24  BLM  [INDC2012L]
L26  BLM  [INDC2012L]
L29  BLM  [CAPC2012N]
L38  BLM  [CAPC2012N]
Q7  IRLML2502  [SOT-23]
Q12  IRLML2502  [SOT-23]
R5  5k6  [RESC1608L]
R6  1k  [RESC1608L]
R8  3k9  [RESC1608L]
R9  1k5  [RESC1608L]
R113  6k2  [RESC1608L]
R114  1k2  [RESC1608L]
R119  10  [RESC2012L]
R120  NU  [RESC1608L]
R121  0  [RESC1608L]
R122  10k  [RESC1608L]
R123  10k  [RESC1608L]
R153  10k  [RESC1608L]
R154  0  [RESC1608L]
R155  10k  [RESC1608L]
R156  0  [RESC1608L]
R157  NU  [RESC1608L]
R158  10  [RESC2012L]
R159  0  [RESC1608L]
R160  10  [RESC2012L]
R161  15k  [RESC1608L]
U1  TPS62220DDC  [SOT95P280X160-5L MO-193AB]
U5  AT91SAM9XE512  [SQFP50P3120X3120-208N]  (part D of 4)
U9  TPS62220DDC  [SOT95P280X160-5L MO-193AB]
U14  LPC1766FBD100  [SOT407-1_L]  (part D of 4)
U19  ST1S10PHR  [SOIC127P600X170_HS-8N]
U20  TPS76333DBVT  [SOT95P280X160-5L MO-193AB]
U22  LP2951A-5.0  [M08A_L]
U23  PIC12F675-I/SN  [SOIC-SN8_N]

### Ports
WDI_CNT (out), WDI_EXT (in)

### Nets
+1v8: C13.2 C14.2 C143.2 C195.2 C196.2 C197.2 C198.2 C199.2 C200.2 C201.2 C202.2 C203.2 C204.2 C205.2 C206.2 C219.1 L5.2 L26.1 R8.1 R119.2 U5.38(VDDCORE) U5.47(VDDBU) U5.77(VDDCORE) U5.147(VDDCORE) U5.174(VDDCORE) U5.203(VDDCORE)
+3v3: C4.2 C5.2 C157.2 C158.2 C159.2 C160.2 C161.2 C162.2 C169.2 C170.2 C171.2 C172.2 C173.2 C174.2 C175.2 C176.2 C177.2 C178.2 C179.2 C180.2 C181.2 C182.2 C183.2 C184.2 C185.2 C186.2 C187.2 C188.2 C189.2 C190.2 C191.2 C192.2 C193.1 C194.1 C207.2 C208.2 C209.2 C210.2 C211.2 C212.2 C213.2 C214.2 C215.2 C216.2 C217.2 C218.2 C245.1 C246.1 L4.2 L24.1 L29.1 R5.1 R157.2 R160.2 U5.5(VDDIOP0) U5.13(VDDIOP0) U5.24(VDDIOP0) U5.32(VDDIOP0) U5.52(VDDIOP0) U5.65(VDDIOM) U5.90(VDDIOM) U5.114(VDDIOM) U5.132(VDDIOM) U5.169(VDDIOP1) U5.187(VDDIOP0) U5.199(VDDIOP0) U14.19(VBAT) U14.28(VDD(3V3)) U14.42(VDD(DCDC)(3V3)) U14.54(VDD(3V3)) U14.71(VDD(3V3)) U14.84(VDD(DCDC)(3V3)) U14.96(VDD(3V3))
+3v3A: C15.1 C16.1 U20.5(OUT)
+5vA: C163.1 C165.1 C166.2 U22.1(OUT) U22.2(SEN)
+5vD: C3.2 C6.2 C141.1 C142.2 L3.2 L7.2 R113.2 R153.1 R155.1 R156.2 U1.1(IN) U9.1(IN)
+Vin: C164.1 C244.2 L38.1 U22.8(IN)
+Vin_filt: C2.2 L38.2 R120.2 U19.1(VINA) U19.2(EN) U19.6(VIN)
GND: C2.1 C3.1 C4.1 C5.1 C6.1 C13.1 C14.1 C137.1 C138.1 C141.2 C142.1 C143.1 C144.1 C145.1 C146.1 C147.1 C148.1 C157.1 C158.1 C159.1 C160.1 C161.1 C162.1 C164.2 C165.2 C166.1 C167.1 C168.1 C169.1 C170.1 C171.1 C172.1 C173.1 C174.1 C175.1 C176.1 C177.1 C178.1 C179.1 C180.1 C181.1 C182.1 C183.1 C184.1 C185.1 C186.1 C187.1 C188.1 C189.1 C190.1 C191.1 C192.1 C193.2 C194.2 C195.1 C196.1 C197.1 C198.1 C199.1 C200.1 C201.1 C202.1 C203.1 C204.1 C205.1 C206.1 C207.1 C208.1 C209.1 C210.1 C211.1 C212.1 C213.1 C214.1 C215.1 C216.1 C217.1 C218.1 C219.2 C220.1 C221.1 C244.1 C245.2 C246.2 Q7.2(S) Q12.2(S) R6.1 R9.1 R114.1 R121.1 R123.1 R161.1 U1.2(GND) U5.6(GND) U5.14(GND) U5.25(GND) U5.33(GND) U5.39(GND) U5.44(GNDBU) U5.53(GND) U5.66(GND) U5.78(GND) U5.91(GND) U5.113(GND) U5.133(GND) U5.146(GND) U5.151(GNDPLL) U5.153(GNDPLL) U5.156(GNDANA) U5.170(GND) U5.173(GND) U5.188(GND) U5.200(GND) U5.204(GND) U9.2(GND) U14.11(VSSA) U14.15(VREFN) U14.31(VSS) U14.41(VSS) U14.55(VSS) U14.72(VSS) U14.83(VSS) U14.97(VSS) U19.4(AGND) U19.5(SYNC) U19.8(PGND) U19.9(TP) U22.3(SD) U22.4(GND) U23.8(VSS)
RFIN_GND: C15.2 C16.2 C18.1 U20.2(GND)
1v8_ON: R154.2 R155.2 U9.3(EN) U23.5(GP2/AN2/T0CKI/INT/COUT)
1v8_SHORT: Q7.1(G) Q12.1(G) R123.2 U23.7(GP0/AN0/CIN+/ICSPDAT)
12v_MEAS: C221.2 R120.1 R121.2 U23.3(GP4/AN3/~{T1G}/OSC2/CLKOUT)
nRES: R159.1
SAM_VREF: C137.2 C138.2 L24.2 U5.160(VDDANA)
WDI_CNT: R122.2 R161.2 ; port WDI_CNT
WDI_EXT: U23.4(GP3/~{MCLR}/VPP) ; port WDI_EXT
NetC18_2: C18.2 L7.1 U20.1(IN) U20.3(EN)
NetC144_2: C144.2 C145.2 C146.2 C147.2 C148.2 L26.2 U5.148(VDDPLL) U5.155(VDDPLL)
NetC163_2: C163.2 U22.6(VO_TAP) U22.7(FB)
NetC167_2: C167.2 C168.2 L29.2 U14.10(VDDA) U14.12(VREF)
NetC220_2: C220.2 R156.1 R157.1 U23.1(VDD)
NetL3_1: L3.1 U19.7(SW)
NetL4_1: L4.1 U1.5(SW)
NetL5_1: L5.1 U9.5(SW)
NetQ7_3: Q7.3(D) R119.1
NetQ12_3: Q12.3(D) R158.1
NetR5_2: R5.2 R6.2 U1.4(FB)
NetR8_2: R8.2 R9.2 U9.4(FB)
NetR113_1: R113.1 R114.2 U19.3(FB)
NetR122_1: R122.1 U23.2(GP5/T1CKI/OSC1/CLKIN)
NetR153_2: R153.2 R154.1 U1.3(EN)
NetR158_2: R158.2 R160.1
NetR159_2: R159.2 U23.6(GP1/AN1/CIN-/VREF/ICSPCLK)

Not connected (* = marked no-connect by the designer): U5 152(NC)*; U14 13(NC)*; U22 5(~{ERR})*

### Notes on the sheet
- SDRAM
- SAM I/O
- NAND
- SAM core
- Misc

### Library data of the parts
C2-C6 C13-C15 C18 C137 C138 C142-C148 C157-C163 C166-C192 C195-C218 C220 C221 C244 = Cap: Capacitor; Value: 100pF; Published: 8-Jun-2000; LatestRevisionDate: 17-Jul-2002; LatestRevisionNote: Re-released for DXP Platform.; PackageReference: RAD-0.3; Publisher: Altium Limited
C16 C141 C164 C165 C193 C194 C219 C245 C246 = Cap Pol: as C102 on sheet INTERFACE; Published: 8-Jun-2000; LatestRevisionDate: 17-Jul-2002; LatestRevisionNote: Re-released for DXP Platform.; PackageReference: C0805; Publisher: Altium Limited
L3-L5 = INDUCTOR
L7 L29 L38 = Ferrite Bead: Code_IEC: 1005; Value: 10mH; Published: 8-Jun-2000; LatestRevisionDate: 17-Jul-2002; LatestRevisionNote: Re-released for DXP Platform.; PackageReference: 0402-A; Publisher: Altium Limited; Code_JEITA: 0402
L24 L26 = Inductor: Code_IEC: 1005; Value: 10mH; Published: 8-Jun-2000; LatestRevisionDate: 17-Jul-2002; LatestRevisionNote: Re-released for DXP Platform.; PackageReference: 0402-A; Publisher: Altium Limited; Code_JEITA: 0402
Q7 Q12 = IRLML2402: HEXFET Power MOSFET; Published: 8-Jun-2000; LatestRevisionDate: 17-Jul-2002; LatestRevisionNote: Re-released for DXP Platform.; DatasheetVersion: Aug-1997; PackageReference: SOT-23; Publisher: Altium Limited; PackageDescription: SOT-23; 3 Leads; Body 3.1 x 2.5 mm, inc. leads (LxW max); ComponentLink1Description: Manufacturer Link; ComponentLink1URL: http://www.irf.com/; ComponentLink2Description: Datasheet; ComponentLink2URL: http://www.irf.com/product-info/datasheets/data/irlml2402.pdf
R5 R8 R9 R113 R114 R119-R123 R153-R161 = Res: Resistor; Value: 1K; Published: 8-Jun-2000; LatestRevisionDate: 04-Mar-2005; LatestRevisionNote: PCB Footprint replaced.; PackageReference: J1-0603; Publisher: Altium Limited
R6 = Res: Resistor; Published: 8-Jun-2000; LatestRevisionDate: 04-Mar-2005; LatestRevisionNote: PCB Footprint replaced.; PackageReference: J1-0603; Publisher: Altium Limited; Value: 1K
U1 U9 = TPS6202: 1.8V 300mA SW regulator
U14 = LPC1766FBD100: as U14 on sheet LPC; Published: 17-Aug-2007; DatasheetVersion: rev.01, Jan-2007; PackageVersion: Feb-2003; PackageReference: SOT407-1; Publisher: Altium Limited; PackageDescription: 100-Pin Plastic Low Profile Quad Flat Pack, LQFP100; Code_JEDEC: MS-026; ComponentLink1Description: Manufacturer Link; ComponentLink1URL: http://www.nxp.com/; ComponentLink2Description: Datasheet; ComponentLink2URL: http://www.standardics.nxp.com/products/lpc2000/datasheet/lpc2364.lpc2366.lpc2368.pdf
U19 = ST1S10: 3 A, 900 kHz, synchronous step-down regulator
U20 = TPS76318: 1.8 V 150 mA low-dropout linear regulator
U22 = LP2951ACDMR2: MicroPower Voltage Regulator; Published: 15-Apr-2002; DatasheetVersion: Oct-1999; PackageVersion: Oct-1999; PackageReference: 846A-02; Publisher: Altium Limited; PackageDescription: Shrink Small Outline; 8 Leads; Body Width 3 mm; Pitch 0.65 mm; ComponentLink1Description: Manufacturer Link; ComponentLink1URL: http://www.onsemi.com/site/products/taxonomy/0,4438,503,00.html; ComponentLink2Description: Datasheet; ComponentLink2URL: http://www.onsemi.com/pub/Collateral/LP2950-D.PDF
U23 = PIC12F675-I/SN: FLASH-Based 8-Bit CMOS Microcontroller, 10-Bit A/D, 8-Pin SOIC 150mil, Industrial Temperature; Note: Refer to data sheet (DS41190F) for details of supply voltage range under different conditions.; FirstPublished: 11-Oct-2004; LatestRevisionDate: 02-Dec-2009; LatestRevisionNote: Updated to datasheet revision revF, Sep-2009.; DatasheetVersion: revF, Sep-2009; PackageVersion: revBB, Aug-2009; PackageReference: SOIC-SN8; Publisher: Altium Limited; PackageDescription: 8-Lead Plastic Small Outline (SN) - Narrow, 3.90mm Body [SOIC]; Supplier 1: Digi-Key; Supplier Part Number 1: PIC12F675-I/SN-ND; Supplier 2: Farnell; Supplier Part Number 2: 9759026; Supplier 3: Farnell; Supplier Part Number 3: 1660011; Supplier 4: Newark; Supplier Part Number 4: 80K7313; Code_JEDEC: MS-012; Code_IPC: SOIC127P600-8; ComponentLink1Description: Datasheet; ComponentLink1URL: http://ww1.microchip.com/downloads/en/DeviceDoc/41190F.pdf; ComponentLink2Description: Packaging Specification; ComponentLink2URL: http://www.microchip.com/stellent/groups/techpub_sg/documents/packagingspec/en012702.pdf; ComponentLink3Description: Microchip.com Home; ComponentLink3URL: http://www.microchip.com/